# Altium schematic sheet stm32.SchDoc
size A4; SheetNumber: 1; SheetTotal: 5; SPICEModelCacheYMAOVTWQ: <root> / <DocumentId>YMAOVTWQ</DocumentId> / <CacheFrame Number="0"> / <Model Name="xtal" Kind="CKT"> / <Text>*Generic type:crystal pkg:HC33/51 / .SUBCKT XTAL 1 2 PARAMS: FREQ=1Meg RS=750 C=13pf Q=1000 / LX 1 3 {((Q*RS)/(6.2831852*FREQ))} IC=0.5M / CX 3 4 {(1/(Q*6.2831852*FREQ*RS))} / C0 1 2 {C} / RS 4 2 {RS} / .ENDS XTAL</Text> / </Model> / </CacheFrame> / </root>
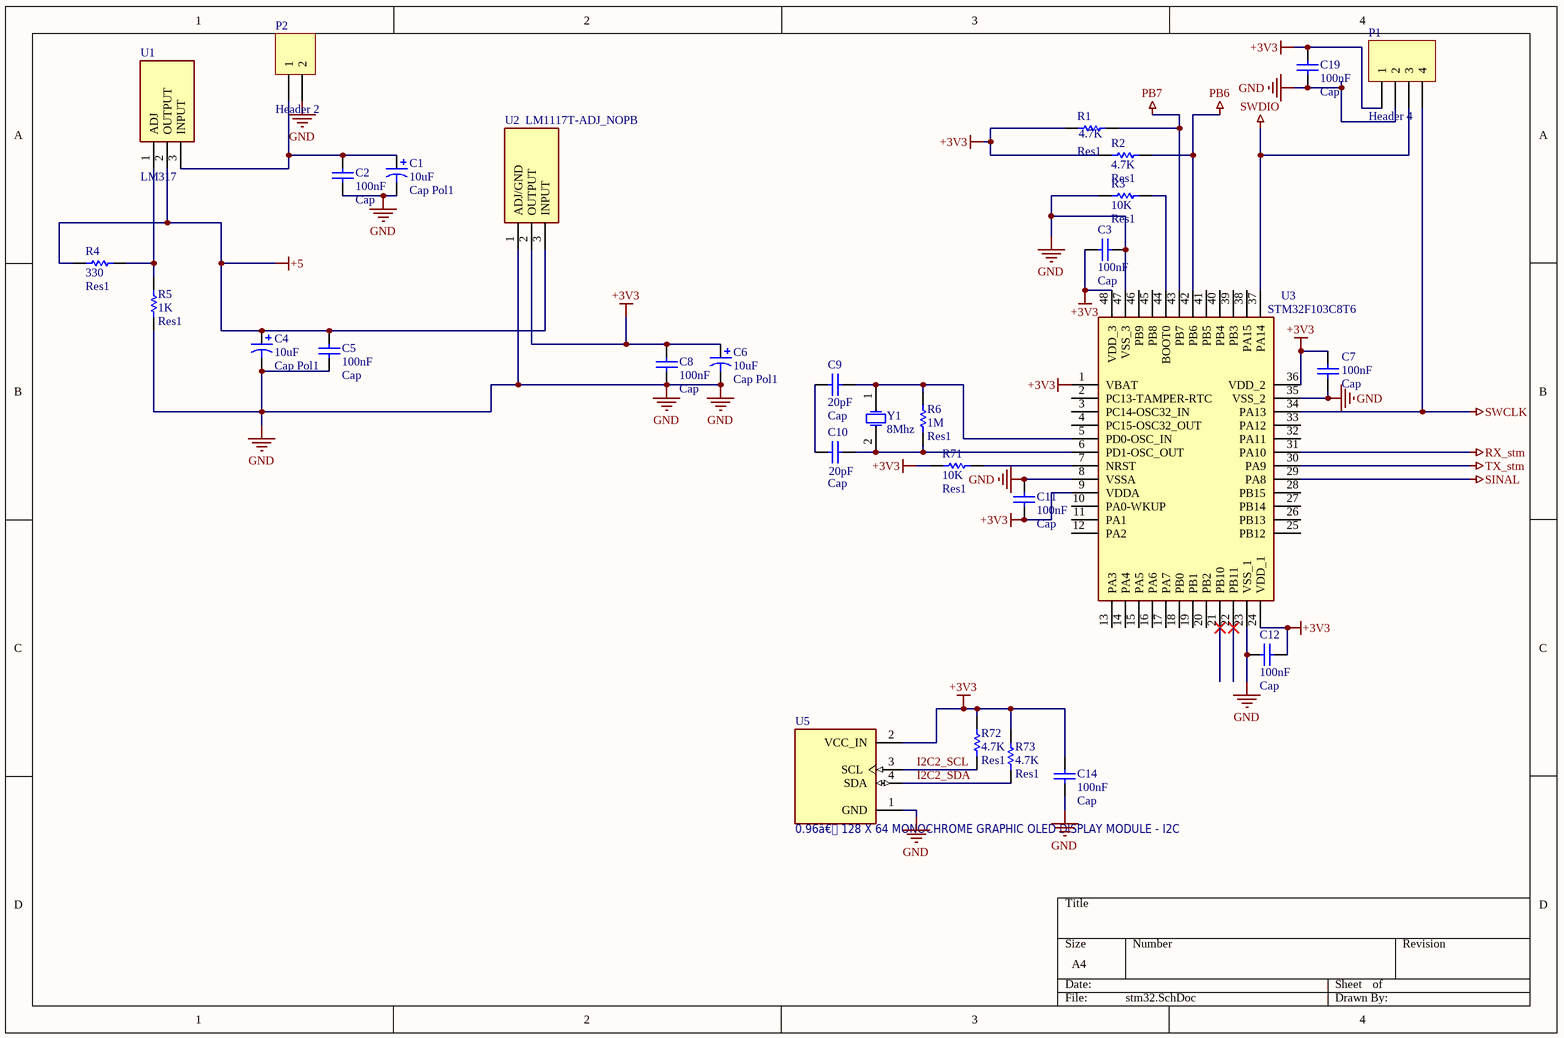
[diagram p0: stm32.SchDoc]

## Parts
C1  Cap Pol1  value 10uF  [CAP+10uF]
C2  Cap  value 100nF  [CAP100N]
C3  Cap  value 100nF  [CAP100N]
C4  Cap Pol1  value 10uF  [CAP+10uF]
C5  Cap  value 100nF  [CAP100N]
C6  Cap Pol1  value 10uF  [CAP+10uF]
C7  Cap  value 100nF  [CAP100N]
C8  Cap  value 100nF  [CAP100N]
C9  Cap  value 20pF  [CAP20pF]
C10  Cap  value 20pF  [CAP20pF]
C11  Cap  value 100nF  [CAP100N]
C12  Cap  value 100nF  [CAP100N]
C14  Cap  value 100nF  [CAP100N]
C19  Cap  value 100nF  [CAP100N]
P1  Header 4  [Header 4, 90]
P2  Header 2  [Terminal block]
R1  Res1  value 4.7K  [RES4.7K]
R2  Res1  value 4.7K  [RES4.7K]
R3  Res1  value 10K  [RES10K]
R4  Res1  value 330  [RES330]
R5  Res1  value 1K  [RES1K]
R6  Res1  value 1M  [RES1M]
R71  Res1  value 10K  [RES10K]
R72  Res1  value 4.7K  [RES4.7K]
R73  Res1  value 4.7K  [RES4.7K]
U1  LM317  [LM317]
U2  LM1117T-ADJ_NOPB  [LM1117T-ADJ_NOPB]
U3  STM32F103C8T6  [STM32F103C8T6]
U5  0.96â€ 128 X 64 MONOCHROME GRAPHIC OLED DISPLAY MODULE - I2C  [OLED]
Y1  8Mhz  [CRISTAL]

## Nets
+3V3: C3.1 C6.1 C7.2 C8.2 C11.1 C12.2 C14.2 C19.1 P1.1 R1.1 R2.1 R71.1 R72.2 R73.2 U2.2(OUTPUT) U3.1(VBAT) U3.9(VDDA) U3.24(VDD_1) U3.36(VDD_2) U3.48(VDD_3) U5.2(VCC_IN)
+5: C4.1 C5.2 R4.1 U1.2(OUTPUT) U2.3(INPUT)
GND: C1.2 C2.1 C3.2 C4.2 C5.1 C6.2 C7.1 C8.1 C11.2 C12.1 C14.1 C19.2 P1.2 P2.2 R3.1 R5.1 U2.1(ADJ/GND) U3.8(VSSA) U3.23(VSS_1) U3.35(VSS_2) U3.47(VSS_3) U5.1(GND)
PB6: R2.2 U3.42(PB6)
PB7: R1.2 U3.43(PB7)
RX_stm: U3.31(PA10)
SINAL: U3.29(PA8)
SWCLK: P1.4 U3.34(PA13)
SWDIO: P1.3 U3.37(PA14)
TX_stm: U3.30(PA9)
I2C2_SCL: R72.1 U5.3(SCL)
I2C2_SDA: R73.1 U5.4(SDA)
NetC1_1: C1.1 C2.2 P2.1 U1.3(INPUT)
NetC9_1: C9.1 C10.1
NetC9_2: C9.2 R6.2 U3.5(PD0-OSC_IN) Y1.1(OSC1)
NetC10_2: C10.2 R6.1 U3.6(PD1-OSC_OUT) Y1.2(OSC2)
NetR3_2: R3.2 U3.44(BOOT0)
NetR4_2: R4.2 R5.2 U1.1(ADJ)
NetR71_2: R71.2 U3.7(NRST)

Not connected (* = marked no-connect by the designer): U3 2(PC13-TAMPER-RTC) 3(PC14-OSC32_IN) 4(PC15-OSC32_OUT) 10(PA0-WKUP) 11(PA1) 12(PA2) 13(PA3) 14(PA4) 15(PA5) 16(PA6) 17(PA7) 18(PB0) 19(PB1) 20(PB2) 21(PB10)* 22(PB11)* 25(PB12) 26(PB13) 27(PB14) 28(PB15) 32(PA11) 33(PA12) 38(PA15) 39(PB3) 40(PB4) 41(PB5) 45(PB8) 46(PB9)

## Library data of the parts
C1 C4 C6 = Cap Pol1: Polarized Capacitor (Radial); Published: 8-Jun-2000; LatestRevisionDate: 17-Jul-2002; LatestRevisionNote: Re-released for DXP Platform.; PackageReference: RB7.6-15; Publisher: Altium Limited; PackageDescription: Polarized Capacitor (Radial); 2 Leads
C2 C3 C5 C7-C12 C14 C19 = Cap: Capacitor; Published: 8-Jun-2000; LatestRevisionDate: 17-Jul-2002; LatestRevisionNote: Re-released for DXP Platform.; PackageReference: RAD-0.3; Publisher: Altium Limited; PackageDescription: Radial Cap, Thru-Hole; 2 Leads; 0.3 in Pin Spacing
P1 = Header 4: Header, 4-Pin; LatestRevisionDate: 17-Jul-2002; LatestRevisionNote: Re-released for DXP Platform.; Publisher: Altium Limited
P2 = Header 2: Header, 2-Pin; LatestRevisionDate: 17-Jul-2002; LatestRevisionNote: Re-released for DXP Platform.; Publisher: Altium Limited
R1-R6 R71-R73 = Res1: Resistor; Published: 8-Jun-2000; LatestRevisionDate: 17-Jul-2002; LatestRevisionNote: Re-released for DXP Platform.; PackageReference: AXIAL-0.3; Publisher: Altium Limited; PackageDescription: Axial Device, Thru-Hole; 2 Leads; 0.3 in Pin Spacing
U1 = LM317: TO-220-3L Plastic-Encapsulate Voltage Regulators; Manufacturer_Name: Changjiang Electronics Tech (CJ); Geometry.Height: 4.67mm; Manufacturer_Part_Number: LM317; Mouser Part Number: *; Mouser Price/Stock: *; Arrow Part Number: *; Arrow Price/Stock: *; Datasheet Link: https://datasheet.lcsc.com/szlcsc/Changjiang-Electronics-Tech-CJ-LM317_C22147.pdf
U2 = LM1117T-ADJ_NOPB: Space saving 800-mA low-dropout linear regulator with internal current limit; Manufacturer_Name: Texas Instruments; Manufacturer_Part_Number: LM1117T-ADJ/NOPB; Geometry.Height: 4.7mm; Mouser Part Number: 926-LM1117T-ADJ/NOPB; Mouser Price/Stock: https://www.mouser.co.uk/ProductDetail/Texas-Instruments/LM1117T-ADJ-NOPB?qs=X1J7HmVL2ZHHdJZdUjLg1w%3D%3D; Arrow Part Number: LM1117T-ADJ/NOPB; Arrow Price/Stock: https://www.arrow.com/en/products/lm1117t-adjnopb/texas-instruments?region=nac; Datasheet Link: http://www.ti.com/lit/gpn/lm1117
U3 = STM32F103C8T6: ARM Cortex-M3 STM32F1 Microcontroller IC 32-Bit Single-Core 72MHz 64KB (64K x 8) FLASH; Manufacturer_Name: Microchip; Geometry.Height: 1.6mm; Manufacturer_Part_Number: STM32F103C8T6; Mouser Part Number: N/A; Mouser Price/Stock: https://www.mouser.co.uk/ProductDetail/Microchip-Technology/STM32F103C8T6?qs=efUn273yAhfiwd6AYsSd5Q%3D%3D; Arrow Part Number: *; Arrow Price/Stock: *; Datasheet Link: https://www.st.com/resource/en/datasheet/stm32f103cb.pdf
U5 = DM-OLED096-636: SnapEDA_Link: https://www.snapeda.com/parts/DM-OLED096-636/Display+Module/view-part/?ref=snap; Package: Package; Value: *; MF: Display Module; MP: DM-OLED096-636; Check_prices: https://www.snapeda.com/parts/DM-OLED096-636/Display+Module/view-part/?ref=eda
Y1 = XTAL: Crystal Oscillator 8Mhz XTAL Crystal, Thru-Hole; 2 Leads; Body 3.1 x 8.2 mm; Published: 8-Jun-2000; LatestRevisionDate: 17-Jul-2002; LatestRevisionNote: Re-released for DXP Platform.; PackageReference: R38; Publisher: Altium Limited; PackageDescription: Crystal, Thru-Hole; 2 Leads; Body 3.1 x 8.2 mm (Dia.xH)